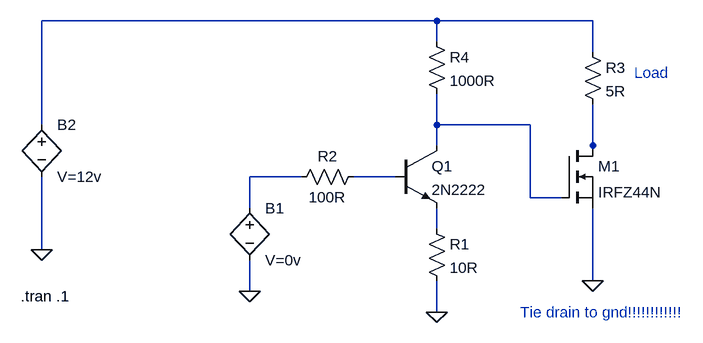
[diagram p0: schematic mosfet-bjt-switch.asc]
mosfet-bjt-switch.asc, the LTspice schematic file:
Version 4
SHEET 1 880 680
WIRE 224 -112 -384 -112
WIRE 464 -112 224 -112
WIRE 224 -80 224 -112
WIRE 464 -64 464 -112
WIRE -384 48 -384 -112
WIRE 224 48 224 0
WIRE 368 48 224 48
WIRE 224 80 224 48
WIRE 464 80 464 16
WIRE 464 96 464 80
WIRE 16 128 -64 128
WIRE 160 128 96 128
WIRE 368 160 368 48
WIRE 416 160 368 160
WIRE -64 176 -64 128
WIRE 224 208 224 176
WIRE -384 240 -384 128
WIRE 464 288 464 176
WIRE -64 304 -64 256
WIRE 224 336 224 288
FLAG -384 240 0
FLAG 224 336 0
FLAG 464 288 0
FLAG -64 304 0
SYMBOL npn 160 80 R0
SYMATTR InstName Q1
SYMATTR Value 2N2222
SYMBOL nmos 416 80 R0
SYMATTR InstName M1
SYMATTR Value IRFZ44N
SYMBOL res 112 112 R90
WINDOW 0 0 56 VBottom 2
WINDOW 3 32 56 VTop 2
SYMATTR InstName R2
SYMATTR Value 100R
SYMBOL bv -384 32 R0
SYMATTR InstName B2
SYMATTR Value V=12v
SYMBOL bv -64 160 R0
SYMATTR InstName B1
SYMATTR Value V=0v
SYMBOL res 208 192 R0
SYMATTR InstName R1
SYMATTR Value 10R
SYMBOL res 208 -96 R0
SYMATTR InstName R4
SYMATTR Value 1000R
SYMBOL res 448 -80 R0
SYMATTR InstName R3
SYMATTR Value 5R
TEXT -416 312 Left 2 !.tran .1
TEXT 352 336 Left 2 ;Tie drain to gnd!!!!!!!!!!!!
TEXT 528 -32 Left 2 ;Load

The netlist it stands for:
* mosfet-bjt-switch.asc
Q1 N002 N005 N006 0 2N2222
M1 N003 N002 0 0 IRFZ44N
R2 N005 N004 100R
B2 N001 0 V=12v
B1 N004 0 V=0v
R1 N006 0 10R
R4 N001 N002 1000R
R3 N001 N003 5R
.model NPN NPN
.model PNP PNP
.lib standard.bjt
.model NMOS NMOS
.model PMOS PMOS
.lib standard.mos
.tran .1
* Tie drain to gnd!!!!!!!!!!!!
* Load
.backanno
.end